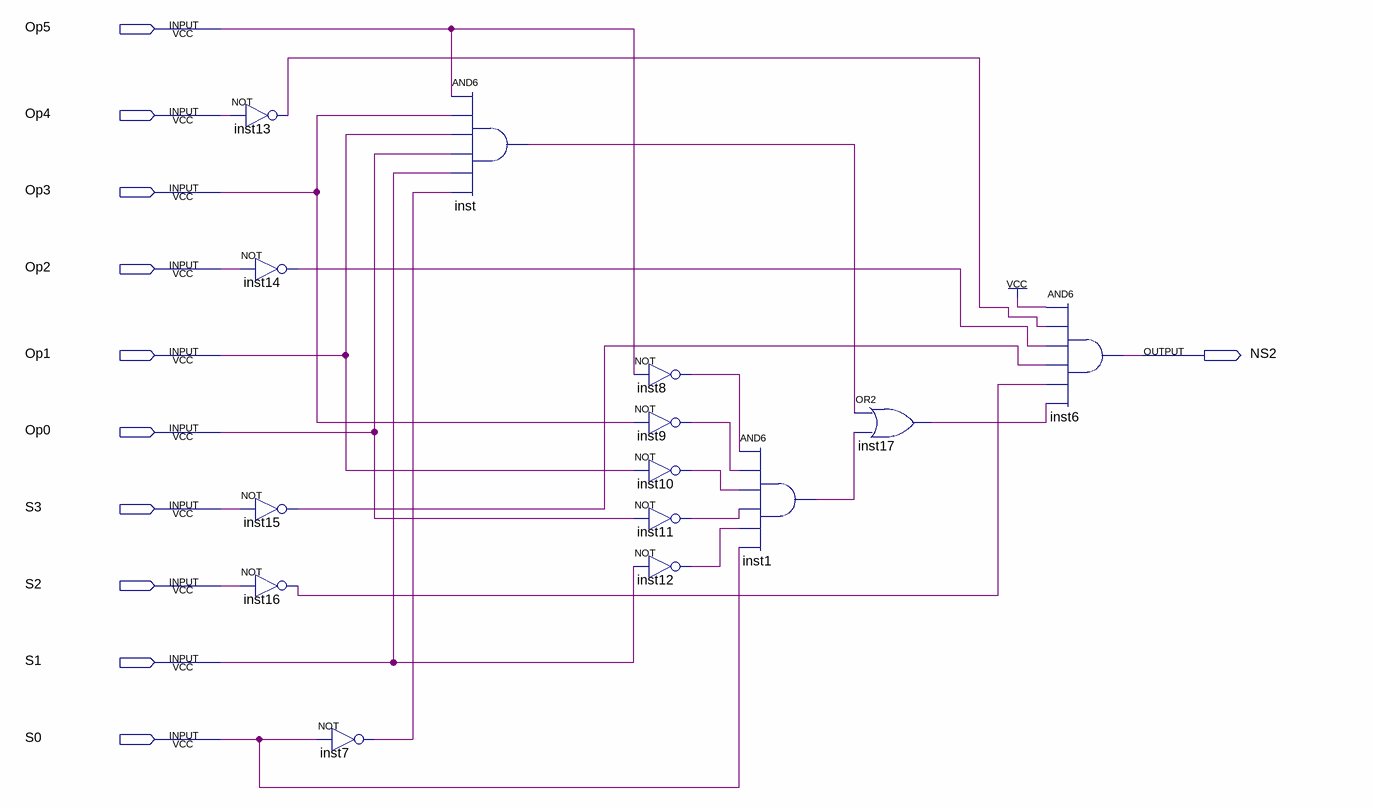
[diagram p0: schematic sheet]
// Quartus schematic NS2.bdf as structural Verilog: 14 symbols, 11 pins
module NS2 (
  input  Op5,
  input  Op4,
  input  Op3,
  input  Op2,
  input  Op1,
  input  Op0,
  input  S3,
  input  S2,
  input  S1,
  input  S0,
  output NS2
);

  wire inst1_out, inst7_out, inst8_out, inst9_out, inst10_out, inst11_out, inst12_out, inst13_out,
       inst14_out, inst15_out, inst16_out, inst17_out, inst_out;

  not inst13 (inst13_out, Op4);
  not inst14 (inst14_out, Op2);
  not inst15 (inst15_out, S3);
  not inst16 (inst16_out, S2);
  not inst7 (inst7_out, S0);
  and inst (inst_out, Op5, Op3, Op1, Op0, S1, inst7_out);
  not inst8 (inst8_out, Op5);
  not inst9 (inst9_out, Op3);
  not inst10 (inst10_out, Op1);
  not inst11 (inst11_out, Op0);
  not inst12 (inst12_out, S1);
  and inst1 (inst1_out, inst8_out, inst9_out, inst10_out, inst11_out, inst12_out, S0);
  or inst17 (inst17_out, inst_out, inst1_out);
  and inst6 (NS2, 1'b1, inst13_out, inst14_out, inst15_out, inst16_out, inst17_out);
endmodule
